# EAGLE design PIC16F687+7segLED (EAGLE 6.2)
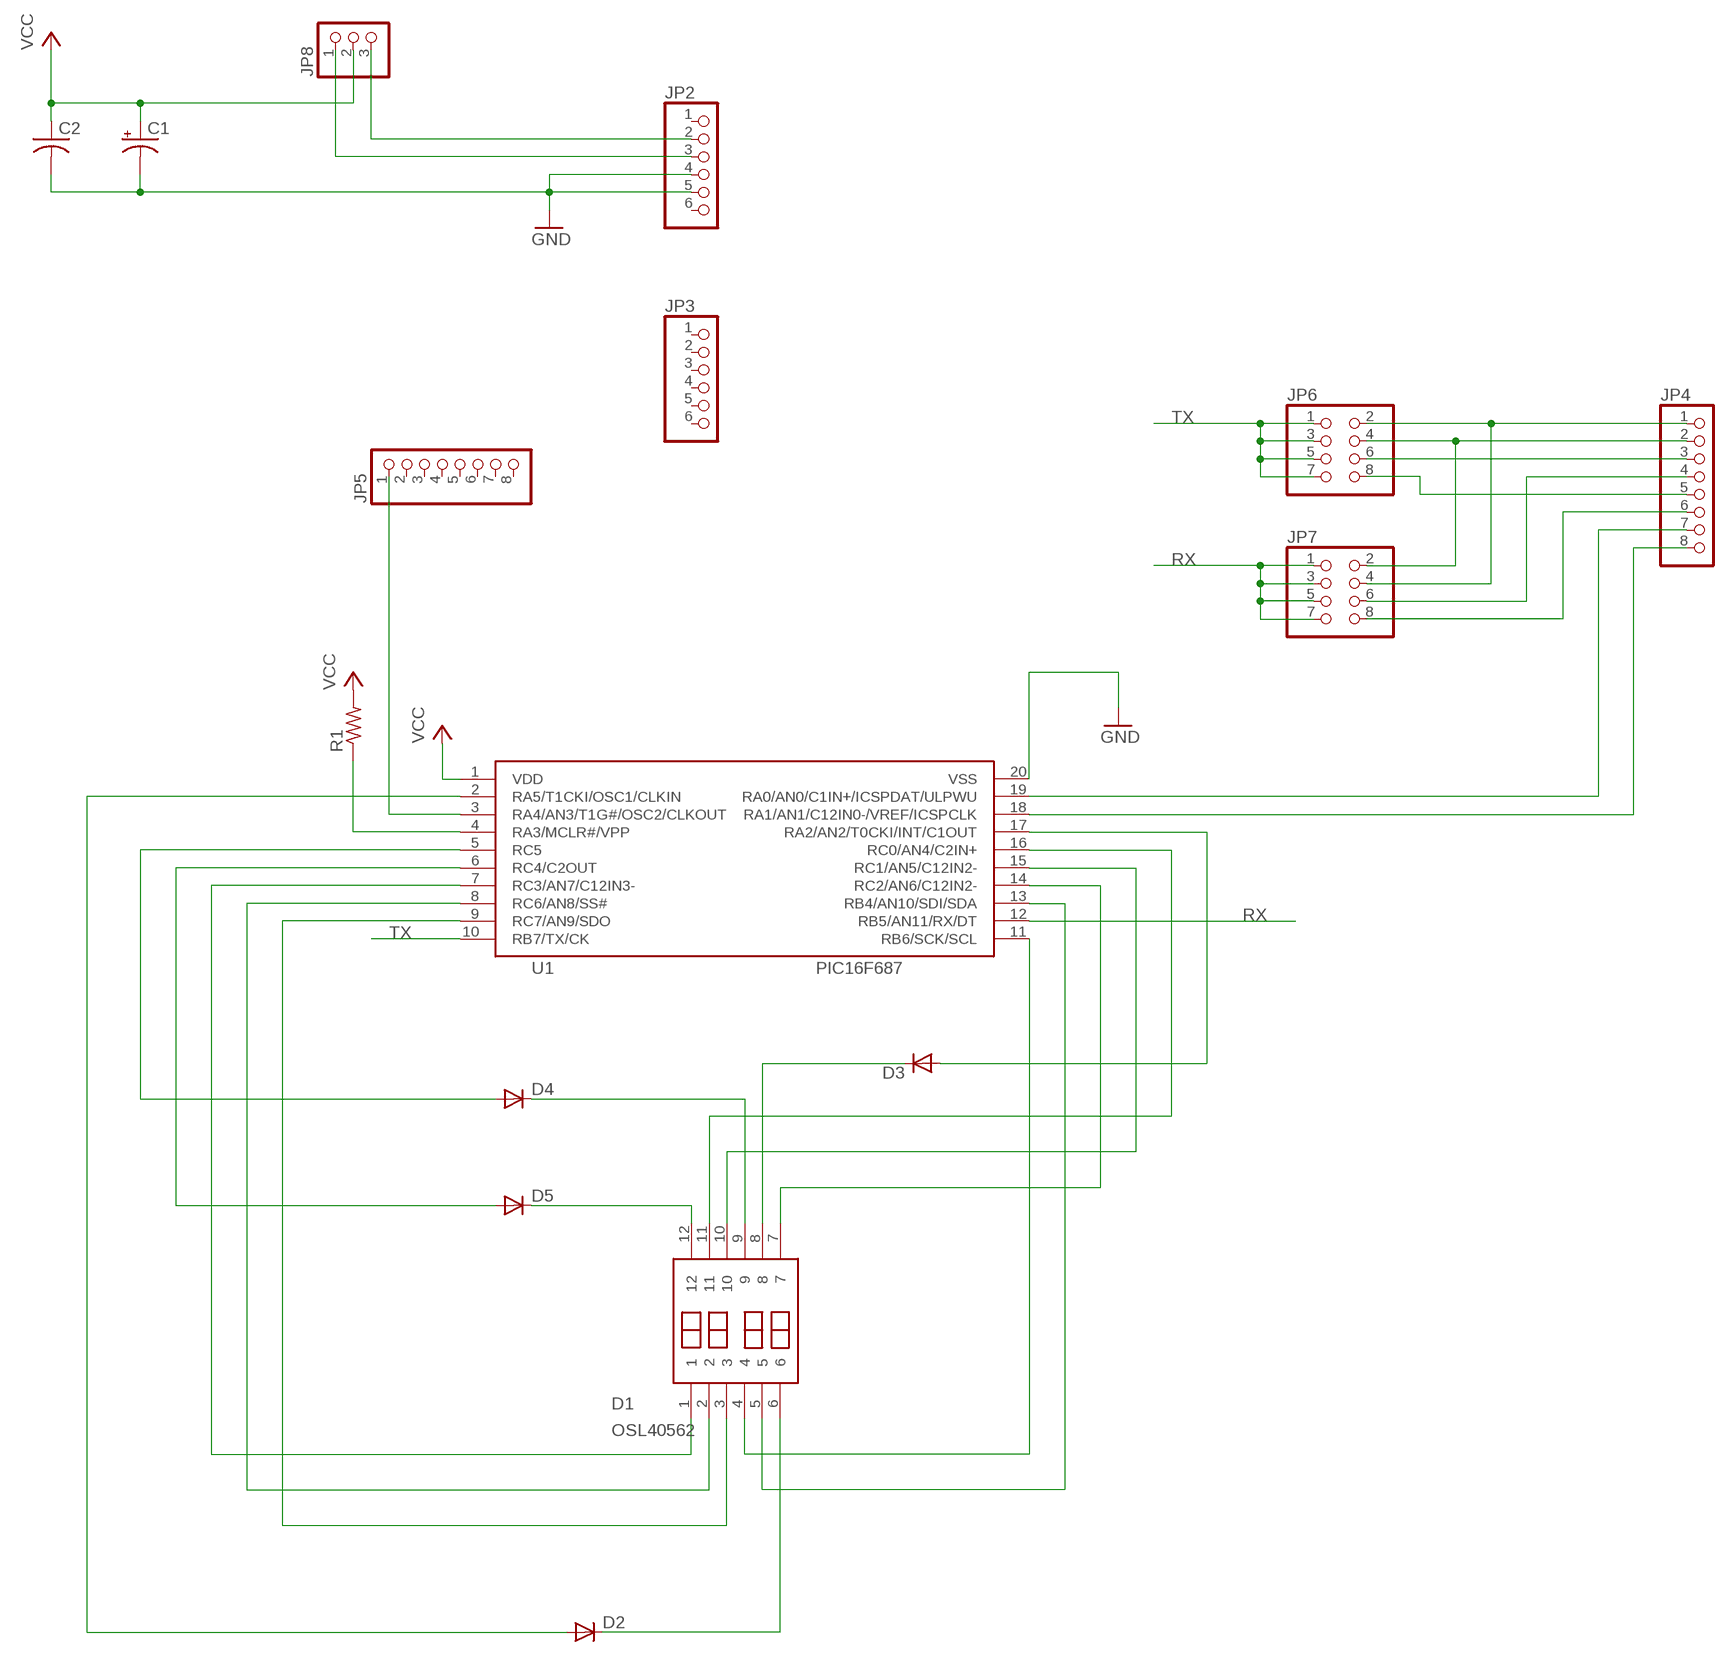
[diagram p0: schematic, sheet 1]

## Parts
C1  CPOL-US  [CPOL-US]
C2  CAP  [C025-040X050]
D1  OSL40562  [OSL40562]
D2  DIODE-01  [0204_D]
D3  DIODE-01  [0204_D]
D4  DIODE-01  [0204_D]
D5  DIODE-01  [0204_D]
JP2  PINHD-1X6  [1X06]
JP3  PINHD-1X6  [1X06]
JP4  PINHD-1X8  [1X08]
JP5  PINHD-1X8  [1X08]
JP6  PINHD-2X4  [2X04]
JP7  PINHD-2X4  [2X04]
JP8  PINHD-1X3  [1X03]
R1  R-US-01  [0204V]
U1  PIC16F687  [DIP20]

## Nets
GND: C1.- C2.2 JP2.4 JP2.5 U1.20(VSS)
N$1: D4.1(A) U1.5(RC5)
N$2: D2.1(A) U1.2(RA5/T1CKI/OSC1/CLKIN)
N$3: D5.1(A) U1.6(RC4/C2OUT)
N$4: D1.1 U1.7(RC3/AN7/C12IN3-)
N$5: D1.2 U1.8(RC6/AN8/SS#)
N$6: D1.3 U1.9(RC7/AN9/SDO)
N$7: D1.4 U1.11(RB6/SCK/SCL)
N$8: D1.5 U1.13(RB4/AN10/SDI/SDA)
N$9: D1.7 U1.14(RC2/AN6/C12IN2-)
N$10: D1.10 U1.15(RC1/AN5/C12IN2-)
N$11: D1.11 U1.16(RC0/AN4/C2IN+)
N$12: D3.1(A) U1.17(RA2/AN2/T0CKI/INT/C1OUT)
N$13: D1.6 D2.2(C)
N$14: D1.8 D3.2(C)
N$15: D1.9 D4.2(C)
N$16: D1.12 D5.2(C)
N$17: R1.1 U1.4(RA3/MCLR#/VPP)
N$18: JP4.7 U1.19(RA0/AN0/C1IN+/ICSPDAT/ULPWU)
N$19: JP4.8 U1.18(RA1/AN1/C12IN0-/VREF/ICSPCLK)
N$20: JP5.1 U1.3(RA4/AN3/T1G#/OSC2/CLKOUT)
N$22: JP4.1 JP6.2 JP7.4
N$23: JP4.2 JP6.4 JP7.2
N$24: JP4.3 JP6.6
N$25: JP4.5 JP6.8
N$26: JP2.2 JP8.3
N$27: JP2.3 JP8.1
N$28: JP4.4 JP7.6
N$29: JP4.6 JP7.8
RX: JP7.1 JP7.3 JP7.5 JP7.7 U1.12(RB5/AN11/RX/DT)
TX: JP6.1 JP6.3 JP6.5 JP6.7 U1.10(RB7/TX/CK)
VCC: C1.+ C2.1 JP8.2 R1.2 U1.1(VDD)
Unconnected: JP2.1 JP2.6 JP3.1 JP3.2 JP3.3 JP3.4 JP3.5 JP3.6 JP5.2 JP5.3 JP5.4 JP5.5 JP5.6 JP5.7 JP5.8

## Library data of the parts
C1 = kimai0827:CPOL-US
C2 = kimai0827:CAP
D1 = kimai0827:OSL40562: 7seg LED
D2-D5 = kimai0827:DIODE-01
JP2 JP3 = pinhead:PINHD-1X6: PIN HEADER
JP4 JP5 = pinhead:PINHD-1X8: PIN HEADER
JP6 JP7 = pinhead:PINHD-2X4: PIN HEADER
JP8 = pinhead:PINHD-1X3: PIN HEADER
R1 = kimai0827:R-US-01
U1 = kimai0827:PIC16F687: PIC16F687

## Net classes
1 VCC: width 0.61 mm, drill 0.406 mm
2 GND: width 0.813 mm, drill 0.406 mm

## Board
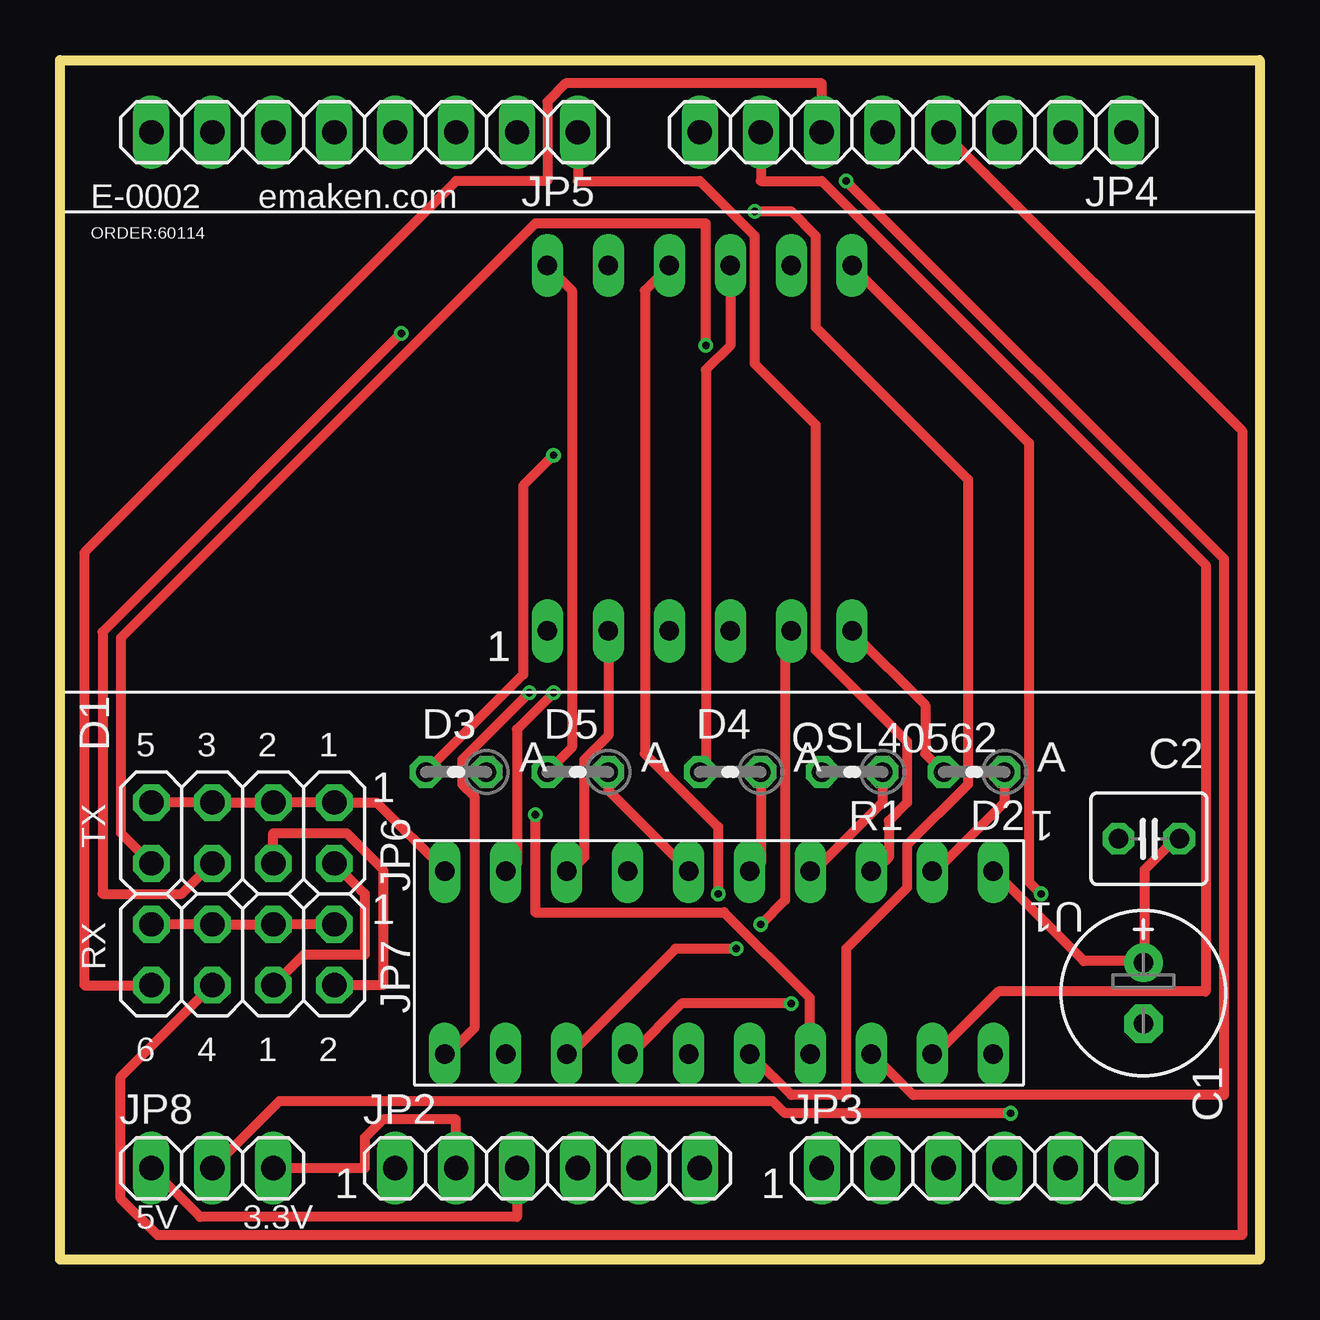
[diagram p1: board, top side]
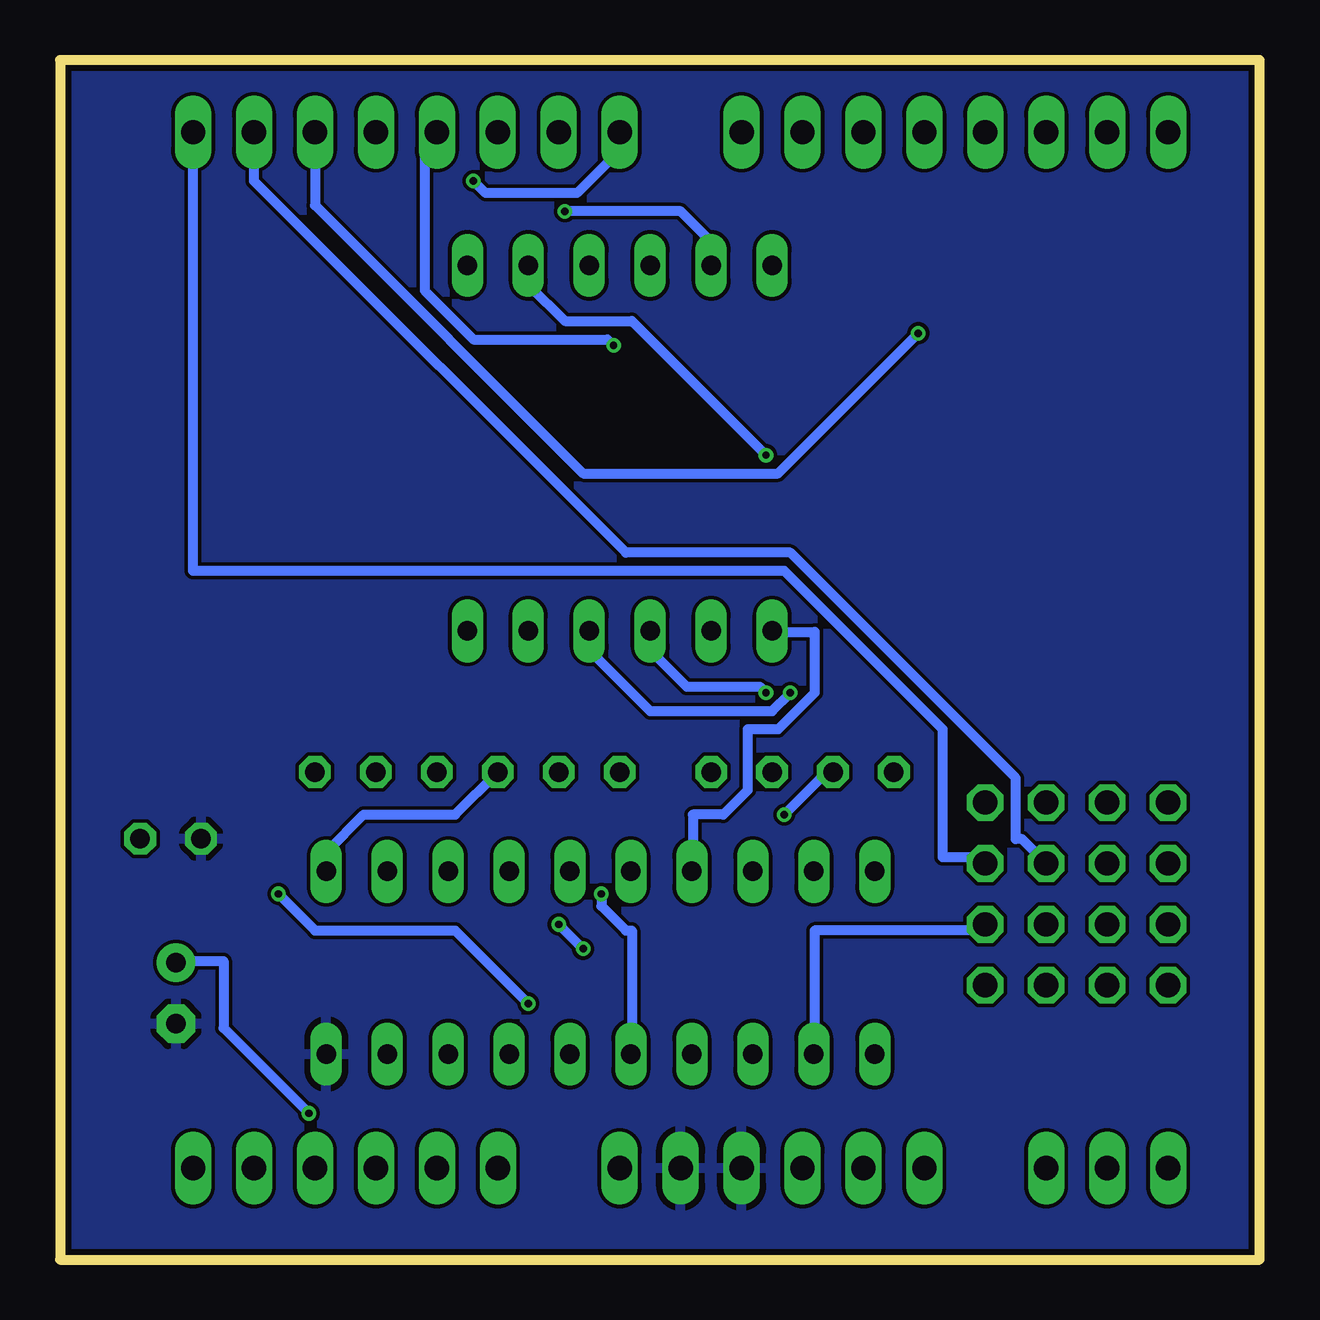
[diagram p2: board, bottom side, seen from below]

Size 50 x 50 mm. Coordinates in mm from the lower left corner, seen from the top.
Outline: 0,50 50,50 50,0 0,0 0,50
Copper layers (1*16): Top 0.035mm / dielectric 1.5mm / Bottom 0.035mm
Design rules: minimum track width 16mil, minimum drill 12mil, track to track 6mil, track to pad 6mil, pad to pad 6mil, via to via 6mil, smd to smd 0mil, copper to edge 10mil, drill to drill 10mil, minimum pad ring 10mil, minimum via ring 6mil, stop-mask expansion 2mil, vias tented up to drill 100mil, thermal gap 10mil

### Footprints (pad centres in the part's own frame; a part is rotated, then mirrored left to right if it is on the bottom)
CPOL-US = drill 0.813 pad 1.6: + 0,0 | drill 0.813 pad 1.6 octagon: - 2.54,0
C025-040X050 = drill 0.813 octagon: 1 0,0; 2 2.54,0
OSL40562 = drill 0.813 long: 1 20.32,2.54; 2 22.86,2.54; 3 25.4,2.54; 4 27.94,2.54; 5 30.48,2.54; 6 33.02,2.54; 7 33.02,17.78; 8 30.48,17.78; 9 27.94,17.78; 10 25.4,17.78; 11 22.86,17.78; 12 20.32,17.78
0204_D = drill 0.813 octagon: 1 0,0; 2 2.54,0
1X06 = drill 1.016 long: 1 -6.35,0; 2 -3.81,0; 3 -1.27,0; 4 1.27,0; 5 3.81,0; 6 6.35,0
1X08 = drill 1.016 long: 1 -8.89,0; 2 -6.35,0; 3 -3.81,0; 4 -1.27,0; 5 1.27,0; 6 3.81,0; 7 6.35,0; 8 8.89,0
2X04 = drill 1.016 octagon: 1 -3.81,-1.27; 2 -3.81,1.27; 3 -1.27,-1.27; 4 -1.27,1.27; 5 1.27,-1.27; 6 1.27,1.27; 7 3.81,-1.27; 8 3.81,1.27
1X03 = drill 1.016 long: 1 -2.54,0; 2 0,0; 3 2.54,0
0204V = drill 0.813 octagon: 1 0,0; 2 2.54,0
DIP20 = drill 0.813 long: 1 0,22.86; 2 0,20.32; 3 0,17.78; 4 0,15.24; 5 0,12.7; 6 0,10.16; 7 0,7.62; 8 0,5.08; 9 0,2.54; 10 0,0; 11 7.62,0; 12 7.62,2.54; 13 7.62,5.08; 14 7.62,7.62; 15 7.62,10.16; 16 7.62,12.7; 17 7.62,15.24; 18 7.62,17.78; 19 7.62,20.32; 20 7.62,22.86

### Placement (x,y rotation side)
C1  45.16,12.37 270 top
C2  46.66,17.54 180 top
D1  0,23.66 0 top
D2  39.37,20.32 180 top
D3  17.78,20.32 180 top
D4  29.21,20.32 180 top
D5  22.86,20.32 180 top
JP2  20.32,3.81 0 top
JP3  38.1,3.81 0 top
JP4  35.56,46.99 180 top
JP5  12.7,46.99 180 top
JP6  7.62,17.78 180 top
JP7  7.62,12.7 180 top
JP8  6.35,3.81 0 top
R1  34.29,20.32 180 top
U1  16.04,16.18 270 top

### Tracks (layer width: path | path; a pad name or v marks a point on that pad's centre or on a via)
GND
  pour Bottom: -1.27,50.8 50.8,50.8 50.8,-1.27 -1.27,-1.27
N$1
  Top 0.406: D4.1 29.21,16.51 28.96,16.26 U1.5
N$2
  Top 0.406: D2.1 39.37,19.05 36.58,16.26 U1.2
N$3
  Top 0.406: D5.1 22.86,19.56 26.16,16.26 U1.6
N$4
  Bottom 0.406: U1.7 23.62,16.26 23.62,18.54 22.35,18.54 21.34,19.56 21.34,22.1 20.07,22.1 18.54,23.62 18.54,26.16 20.32,26.16 D1.1
N$5
  Top 0.406: D1.2 22.86,21.84 21.84,20.83 21.84,16.76 21.34,16.26 U1.8
N$6  (via drill 0.3)
  Top 0.406: v20.57,23.62 19.05,22.1 19.05,16.51 18.8,16.26 U1.9
  Bottom 0.406: v20.57,23.62 20.83,23.88 23.88,23.88 25.4,25.4 D1.3
N$7  (via drill 0.3)
  Top 0.406: v19.56,23.62 16.76,20.83 16.76,19.81 17.27,19.3 17.27,9.65 16.26,8.64 U1.11
  Bottom 0.406: v19.56,23.62 20.32,22.86 25.4,22.86 27.94,25.4 D1.4
N$8  (via drill 0.3)
  Top 0.406: v28.19,12.95 25.65,12.95 21.34,8.64 U1.13 | v29.21,13.97 30.23,14.99 30.23,25.91 30.48,26.16 D1.5
  Bottom 0.406: v29.21,13.97 v28.19,12.95
N$9  (via drill 0.3)
  Top 0.406: v30.48,10.67 25.91,10.67 23.88,8.64 U1.14 | v40.89,15.24 40.39,15.75 40.39,34.04 33.02,41.4 D1.7
  Bottom 0.406: v30.48,10.67 33.53,13.72 39.37,13.72 v40.89,15.24
N$10  (via drill 0.3)
  Top 0.406: v27.43,15.24 27.43,18.03 24.38,21.08 24.38,40.39 25.4,41.4 D1.10
  Bottom 0.406: v27.43,15.24 27.43,14.73 26.42,13.72 26.16,13.72 26.16,8.64 U1.15
N$11  (via drill 0.3)
  Top 0.406: v28.96,43.69 30.48,43.69 31.5,42.67 31.5,38.86 37.85,32.51 37.85,19.81 35.31,17.27 35.31,15.49 32.77,12.95 32.77,6.86 30.48,6.86 28.96,8.38 U1.16
  Bottom 0.406: v28.96,43.69 24.13,43.69 22.86,42.42 D1.11
N$12  (via drill 0.3)
  Top 0.406: v19.81,18.54 19.81,14.48 27.69,14.48 31.24,10.92 31.24,8.64 U1.17
  Bottom 0.406: v19.81,18.54 18.03,20.32 D3.1
N$13
  Top 0.406: D2.2 36.07,21.08 36.07,23.11 33.02,26.16 D1.6
N$14  (via drill 0.3)
  Top 0.406: D3.2 19.3,24.38 19.3,32.26 v20.57,33.53
  Bottom 0.406: v20.57,33.53 26.16,39.12 28.96,39.12 30.48,40.64 D1.8
N$15
  Top 0.406: D4.2 26.92,20.57 26.92,37.08 27.94,38.1 D1.9
N$16
  Top 0.406: D5.2 21.34,21.34 21.34,40.39 20.32,41.4 D1.12
N$17
  Top 0.406: R1.1 34.29,19.05 31.5,16.26 U1.4
N$18
  Top 0.406: JP4.7 29.21,44.96 31.75,44.96 47.75,28.96 47.75,11.18 39.12,11.18 36.58,8.64 U1.19
N$19  (via drill 0.3)
  Top 0.406: v32.77,44.96 48.51,29.21 48.51,6.86 35.56,6.86 34.04,8.38 U1.18
  Bottom 0.406: v32.77,44.96 32.26,44.45 28.45,44.45 26.67,46.23 JP4.8
N$20
  Top 0.406: JP5.1 21.59,44.96 26.67,44.96 28.96,42.67 28.96,37.34 31.5,34.8 31.5,25.4 35.31,21.59 35.31,19.05 34.54,18.29 34.54,16.76 34.04,16.26 U1.3
N$22
  Top 0.406: JP7.4 10.16,12.7 12.7,12.7 12.7,15.24 JP6.2
  Bottom 0.406: JP4.1 44.45,28.7 19.81,28.7 13.21,22.1 13.21,16.76 11.68,16.76 JP6.2
N$23
  Top 0.406: JP7.2 13.46,11.43 13.46,16.26 11.94,17.78 8.89,17.78 JP6.4
  Bottom 0.406: JP4.2 41.91,44.96 26.42,29.46 19.56,29.46 10.16,20.07 10.16,17.53 9.91,17.53 JP6.4
N$24  (via drill 0.3)
  Top 0.406: JP6.6 5.08,15.24 1.78,15.24 1.78,26.16 v14.22,38.61
  Bottom 0.406: v14.22,38.61 20.07,32.77 28.19,32.77 39.37,43.94 JP4.3
N$25  (via drill 0.3)
  Top 0.406: JP6.8 2.54,17.78 2.54,25.91 19.81,43.18 26.92,43.18 v26.92,38.1
  Bottom 0.406: v26.92,38.1 27.18,38.35 32.77,38.35 34.8,40.39 34.8,46.99 JP4.5
N$26
  Top 0.406: JP8.3 12.7,3.81 12.7,5.08 13.46,5.84 16.51,5.84 JP2.2
N$27
  Top 0.406: JP8.1 5.84,1.78 19.05,1.78 JP2.3
N$28
  Top 0.406: JP7.6 2.54,7.62 2.54,2.54 4.06,1.02 49.28,1.02 49.28,34.54 JP4.4
N$29
  Top 0.406: JP7.8 1.02,11.43 1.02,29.46 16.51,44.96 20.32,44.96 20.32,48.26 21.08,49.02 31.75,49.02 JP4.6
RX
  Top 0.406: JP7.7 JP7.5 JP7.3 JP7.1
  Bottom 0.406: JP7.1 11.68,13.72 18.54,13.72 18.54,8.64 U1.12
TX
  Top 0.406: JP6.7 JP6.5 JP6.3 JP6.1 13.21,19.05 16,16.26 U1.10
VCC  (via drill 0.3)
  Top 0.406: U1.1 39.12,16 42.67,12.45 44.96,12.45 C1.+ 45.21,12.45 45.21,16.26 46.48,17.53 C2.1 | JP8.2 9.14,6.6 29.72,6.6 30.23,6.1 v39.62,6.1
  Bottom 0.406: R1.2 33.53,18.54 37.34,18.54 38.86,17.02 38.86,16.26 U1.1 | v39.62,6.1 43.18,9.65 43.18,12.45 44.96,12.45 C1.+

### Text on the board
tNames: E-0002 | emaken.com | ORDER:60114 | 5 | 3 | 2 | 1 | TX | RX | 6 | 4 | 1 | 2 | 5V | 3.3V